# Altium schematic sheet I2C_SW.SchDoc: I2C SW
size 420 x 297 mm; Organization: Altium Limited; Address1: L3, 12a Rodborough Rd; Address2: Frenchs Forest; Address3: NSW; Address4: Australia 2086; DocumentNumber: 14; SheetNumber: 15; SheetTotal: 15
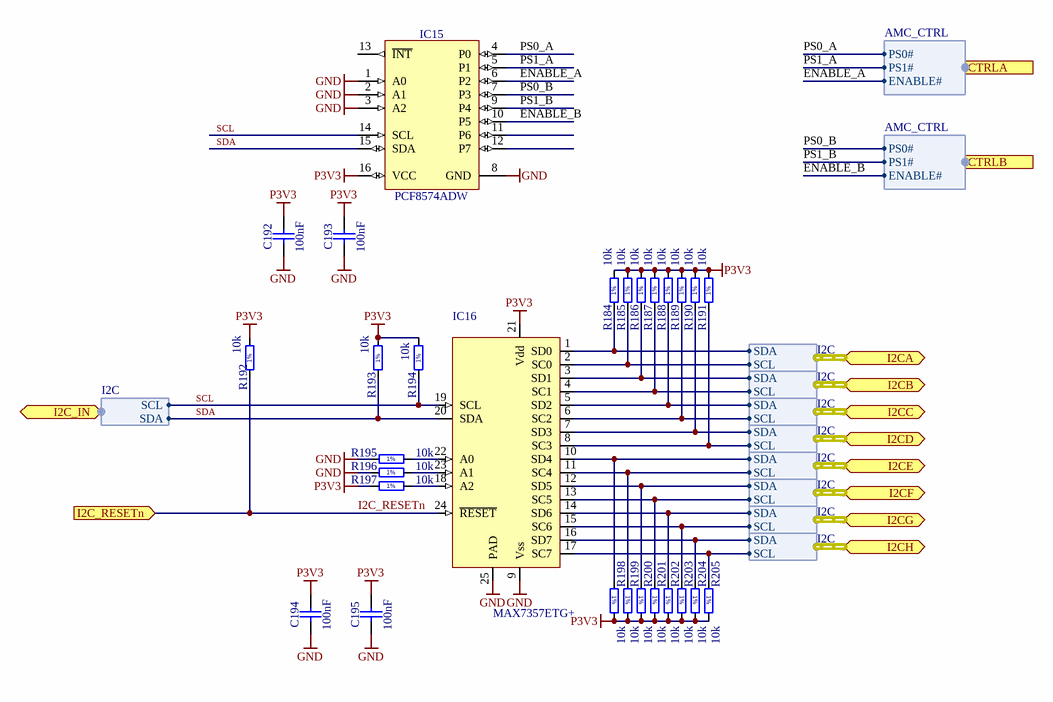
[diagram p0: I2C_SW.SchDoc]

## Parts
C192  100nF  [CAPC0603X33N]
C193  100nF  [CAPC0603X33N]
C194  100nF  [CAPC0603X33N]
C195  100nF  [CAPC0603X33N]
IC15  PCF8574ADW  [SOIC127P1030X265-16N]
IC16  MAX7357ETG+  [HVQFN24]
R184  10k  [RESC1005X40N]
R185  10k  [RESC1005X40N]
R186  10k  [RESC1005X40N]
R187  10k  [RESC1005X40N]
R188  10k  [RESC1005X40N]
R189  10k  [RESC1005X40N]
R190  10k  [RESC1005X40N]
R191  10k  [RESC1005X40N]
R192  10k  [RESC1005X40N]
R193  10k  [RESC1005X40N]
R194  10k  [RESC1005X40N]
R195  10k  [RESC1005X40N]
R196  10k  [RESC1005X40N]
R197  10k  [RESC1005X40N]
R198  10k  [RESC1005X40N]
R199  10k  [RESC1005X40N]
R200  10k  [RESC1005X40N]
R201  10k  [RESC1005X40N]
R202  10k  [RESC1005X40N]
R203  10k  [RESC1005X40N]
R204  10k  [RESC1005X40N]
R205  10k  [RESC1005X40N]

## Ports
CTRLA (harness AMC_CTRL), CTRLB (harness AMC_CTRL), I2C_IN (harness I2C), I2C_RESETn (in), I2CA (harness I2C), I2CB (harness I2C), I2CC (harness I2C), I2CD (harness I2C), I2CE (harness I2C), I2CF (harness I2C), I2CG (harness I2C), I2CH (harness I2C)

## Harnesses
I2C: SCL, SDA
AMC_CTRL: PS0#, PS1#, ENABLE#

## Nets
GND: C192.1 C193.1 C194.1 C195.1 IC15.1(A0) IC15.2(A1) IC15.3(A2) IC15.8(GND) IC16.9(Vss) IC16.25(PAD) R195.1 R196.1
P3V3: C192.2 C193.2 C194.2 C195.2 IC15.16(VCC) IC16.21(Vdd) R184.2 R185.2 R186.2 R187.2 R188.2 R189.2 R190.2 R191.2 R192.2 R193.2 R194.2 R197.1 R198.2 R199.2 R200.2 R201.2 R202.2 R203.2 R204.2 R205.2
ENABLE_A: IC15.6(P2) ; port CTRLA.ENABLE#
ENABLE_B: IC15.10(P5) ; port CTRLB.ENABLE#
I2C_RESETn: IC16.24(~{RESET}) R192.1 ; port I2C_RESETn
PS0_A: IC15.4(P0) ; port CTRLA.PS0#
PS0_B: IC15.7(P3) ; port CTRLB.PS0#
PS1_A: IC15.5(P1) ; port CTRLA.PS1#
PS1_B: IC15.9(P4) ; port CTRLB.PS1#
SCL: IC15.14(SCL) IC16.19(SCL) R194.1 ; port I2C_IN.SCL
SDA: IC15.15(SDA) IC16.20(SDA) R193.1 ; port I2C_IN.SDA
NetIC16_1: IC16.1(SD0) R184.1 ; port I2CA.SDA
NetIC16_2: IC16.2(SC0) R185.1 ; port I2CA.SCL
NetIC16_3: IC16.3(SD1) R186.1 ; port I2CB.SDA
NetIC16_4: IC16.4(SC1) R187.1 ; port I2CB.SCL
NetIC16_5: IC16.5(SD2) R188.1 ; port I2CC.SDA
NetIC16_6: IC16.6(SC2) R189.1 ; port I2CC.SCL
NetIC16_7: IC16.7(SD3) R190.1 ; port I2CD.SDA
NetIC16_8: IC16.8(SC3) R191.1 ; port I2CD.SCL
NetIC16_10: IC16.10(SD4) R198.1 ; port I2CE.SDA
NetIC16_11: IC16.11(SC4) R199.1 ; port I2CE.SCL
NetIC16_12: IC16.12(SD5) R200.1 ; port I2CF.SDA
NetIC16_13: IC16.13(SC5) R201.1 ; port I2CF.SCL
NetIC16_14: IC16.14(SD6) R202.1 ; port I2CG.SDA
NetIC16_15: IC16.15(SC6) R203.1 ; port I2CG.SCL
NetIC16_16: IC16.16(SD7) R204.1 ; port I2CH.SDA
NetIC16_17: IC16.17(SC7) R205.1 ; port I2CH.SCL
NetIC16_18: IC16.18(A2) R197.2
NetIC16_22: IC16.22(A0) R195.2
NetIC16_23: IC16.23(A1) R196.2

Not connected (* = marked no-connect by the designer): IC15 11(P6) 12(P7) 13(~{INT})

## Notes on the sheet
- Project/Equipment
- Document
- uTCA RTM 8 SFP+
- Designer
- Drawn by
- Check.by
- Copyright Creotech Instruments SA 2014.
  This documentation describes Open Hardware and is licensed under the CERN OHL v.1.1. You may redistribute and modify this documentation under the terms of the CERN OHL v.1.1. (http://ohwr.org/CERNOHL). This documentation is distributed WITHOUT ANY EXPRESS OR IMPLIED WARRANTY, INCLUDING OF MERCHANTABILITY, SATISFACTORY QUALITY AND FITNESS FOR A PARTICULAR PURPOSE. Please see the CERN OHL v.1.1 for applicable conditions.
- Creotech Instruments S.A.
- File
- Last Mod.
- Print Date
- Sheet
- Size
- A3
- of
- Rev
- (in symbol R0402_10K_1%_0.0625W_100PPM) 1%

## Library data of the parts
C192-C195 = CC0201_100NF_6.3V_10%_X5R: Non-polarised capacitor; Part Description: SMD Multilayer Chip Ceramic Capacitor; Manufacturer: GENERIC; Manufacturer1 Part Number: 02016D104KAT2A; Voltage: 6.3V; TC: X5R; Tolerance: ±10%; Table: Capacitors SMD; Part Number: CC0201_100NF_6.3V_10%_X5R; Component Kind: Standard; Component Type: Standard; Pin Count: 2; Value: 100nF; Status: Not Recommended; Manufacturer Part Number: CC0201_100NF_6.3V_10%_X5R; Case: 0201; Mounted: Yes; Socket: No; SMD: Yes; Manufacturer1 Example: AVX; Manufacturer1 ComponentHeight: 0.33mm; HelpURL: \\cern.ch\dfs\Applications\Altium\Datasheets\CC0201_X5R_AVX.pdf; Author: CERN DEM JLC; CreateDate: 2007-12-03; LatestRevisionDate: 2007-12-03
IC15 = PCF8574ADW: Remote 8-bit I/O Expander For I2C Bus; Manufacturer: TEXAS INSTRUMENTS; Table: Analog & Interface; Part Number: PCF8574ADW; Component Kind: Standard; Component Type: Standard; Device: PCF8574ADW; PackageDescription: SOIC 16, Pitch 1.27mm - Body 7.5x10.3mm, IPC Medium Density; Part Description: Remote 8-bit I/O Expander For I2C Bus; Manufacturer Part Number: PCF8574ADW; Pin Count: 16; Case: SOIC16W; Mounted: Yes; Socket: No; SMD: Yes; ComponentHeight: 2.65mm; Author: CERN DEM JLC; HelpURL: \\cern.ch\dfs\Applications\Altium\Datasheets\PCF8574ADW.pdf; CreateDate: 2012-11-01; LatestRevisionDate: 2012-11-01
IC16 = IIC_MUX_MAX7357ETG+: 8-channel I2C-bus multiplexer with reset, INT and timeout
R184-R205 = R0402_10K_1%_0.0625W_100PPM: Resistor - 1%; Part Description: General Purpose Thick Film Chip Resistor; Manufacturer: GENERIC; Manufacturer1 Part Number: 232270671003L; TC: ±100ppm/°C; Table: Resistors SMD; Part Number: R0402_10K_1%_0.0625W_100PPM; Component Kind: Standard; Component Type: Standard; Pin Count: 2; Value: 10k; Status: Not recommended; Power: 0.0625W; Tolerance: ±1%; Manufacturer Part Number: R0402_10K_1%_0.0625W_100PPM; Case: 0402; Mounted: Yes; Socket: No; SMD: Yes; Manufacturer1 Example: YAGEO PHYCOMP; Manufacturer1 ComponentHeight: 0.4mm; HelpURL: \\cern.ch\dfs\Applications\Altium\Datasheets\R0402_Phycomp_RC0402.pdf; Author: CERN DEM JLC; CreateDate: 2007-12-03; LatestRevisionDate: 2012-10-17